# EAGLE design DS1307 (EAGLE 5.06)
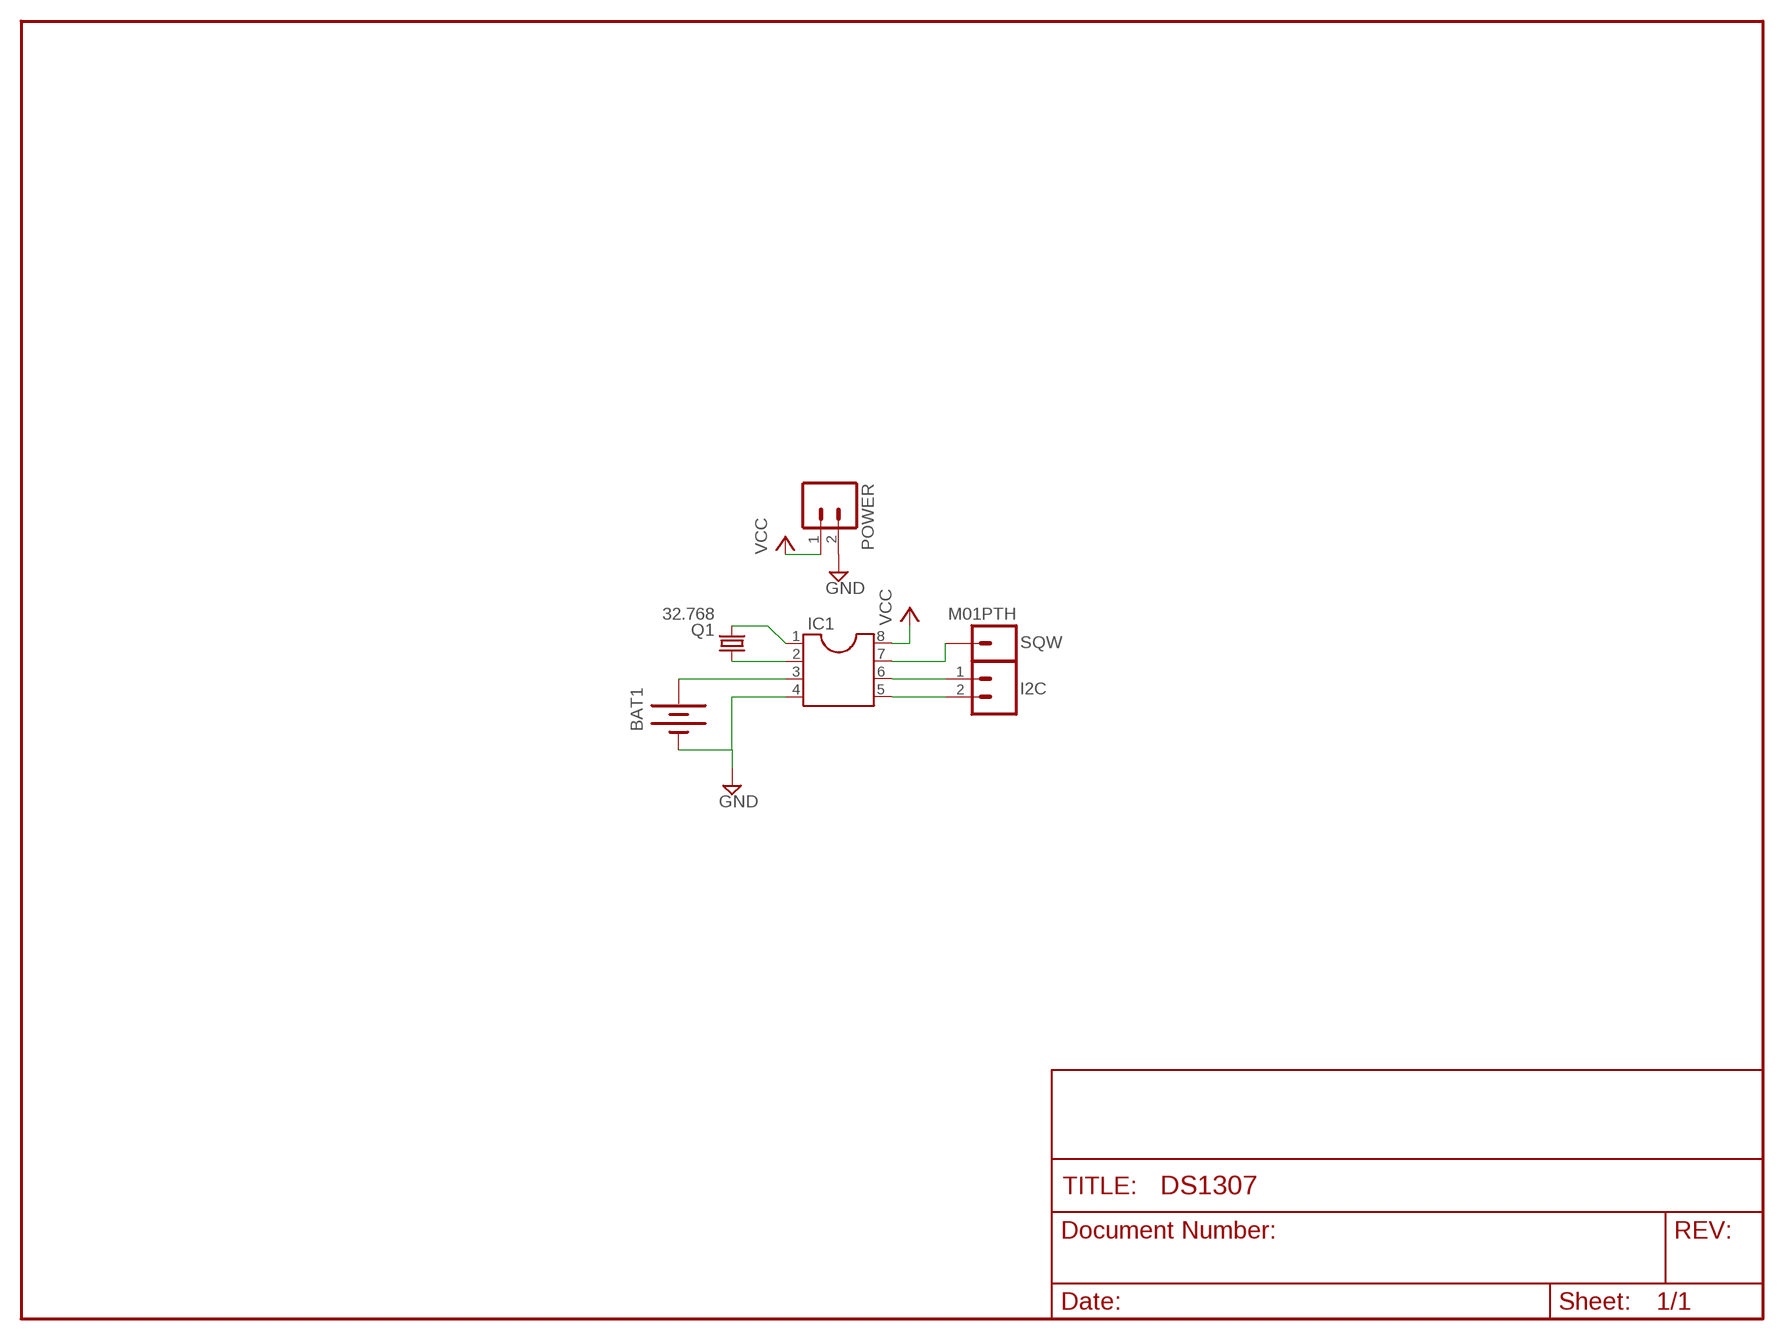
[diagram p0: schematic, sheet 1]

## Parts
BAT1  BATTERY12PTH  [BATTCON_12MM_PTH]
I2C  M02LOCK  [1X02_LOCK]
IC1  DIL8  [DIL08]
POWER  M02LOCK  [1X02_LOCK]
Q1  32.768  CRYSTALTC38H  [TC38H]
SQW  M01PTH  [1X01]

## Nets
GND: BAT1.GND(-) IC1.4 POWER.2
N$1: I2C.1 IC1.6
N$2: BAT1.VCC@1(+) IC1.3
N$3: IC1.1 Q1.2
N$4: IC1.2 Q1.1
N$5: I2C.2 IC1.5
N$6: IC1.7 SQW.1
VCC: IC1.8 POWER.1

## Library data of the parts
BAT1 = SparkFun:BATTERY: Battery Holders Various common sizes : AA, AAA, 20mm coin cell and 12mm coin cell.
I2C POWER = SparkFun:M02: Header 2 Standard 2-pin 0.1" header. Use with straight break away headers (SKU : PRT-00116), right angle break away headers (PRT-00553), swiss pins (PRT-00743), machine pins (PRT-00117), and female headers (PRT-00115). Molex polarized connector foot print use with SKU : PRT-08233 with associated crimp pins and housings.
IC1 = ic-package:DIL8: Dual In Line / Socket
Q1 = crystal:CRYSTAL: CRYSTAL
SQW = SparkFun:M01: Header 1 Standard 1-pin 0.1" header. Use with straight break away headers (SKU : PRT-00116), right angle break away headers (PRT-00553), swiss pins (PRT-00743), machine pins (PRT-00117), and female headers (PRT-00115).

## Board
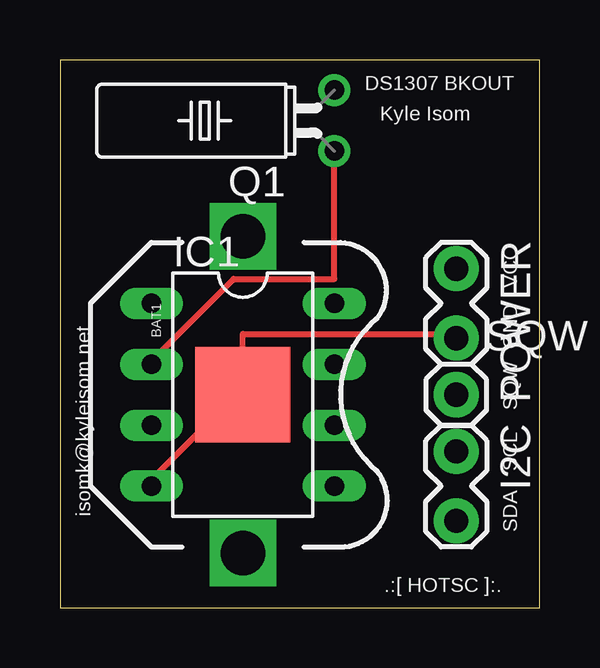
[diagram p1: board, top side]
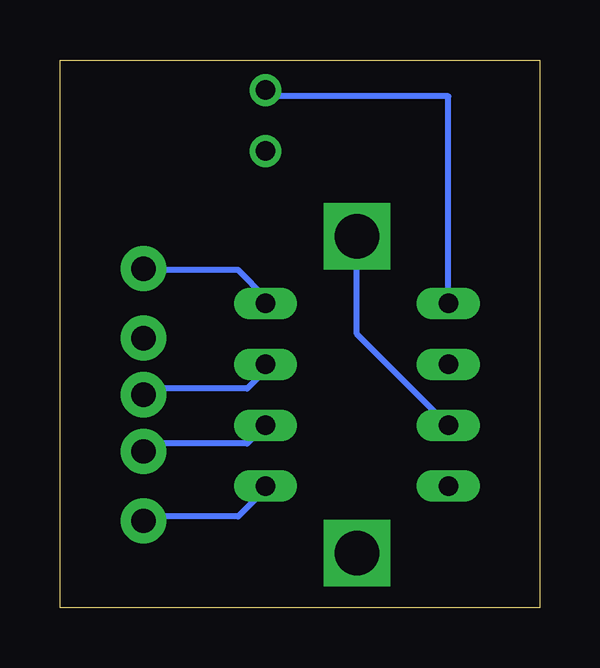
[diagram p2: board, bottom side, seen from below]

Size 19.99 x 22.85 mm. Coordinates in mm from the lower left corner, seen from the top.
Outline: 0,0 19.99,0 19.99,22.85 0,22.85 0,0
Copper layers (1*16): Top 0.035mm / dielectric 1.5mm / Bottom 0.035mm
Design rules "default": minimum track width 10mil, minimum drill 24mil, track to track 8mil, track to pad 8mil, pad to pad 8mil, via to via 8mil, smd to smd 8mil, copper to edge 40mil, drill to drill 8mil, minimum pad ring 10mil, minimum via ring 8mil, stop-mask expansion 4mil, vias tented up to drill 0mil, thermal gap 10mil

### Footprints (pad centres in the part's own frame; a part is rotated, then mirrored left to right if it is on the bottom)
BATTCON_12MM_PTH = smd 3.962 x 3.962: GND 0,0 | drill 1.854 square: VCC@1 -6.604,0; VCC@2 6.604,0
1X02_LOCK = drill 1.016 pad 1.88 round: 1 -0.178,0; 2 2.718,0
DIL08 = drill 0.813 long: 1 -3.81,-3.81; 2 -1.27,-3.81; 3 1.27,-3.81; 4 3.81,-3.81; 5 3.81,3.81; 6 1.27,3.81; 7 -1.27,3.81; 8 -3.81,3.81
TC38H = drill 0.813 round: 1 -1.27,0; 2 1.27,0
1X01 = drill 1.016 pad 1.88 round: 1 0,0

### Placement (x,y rotation side)
BAT1  7.62,8.89 270 top
I2C  16.51,6.35 270 top
IC1  7.62,8.89 270 top
POWER  16.51,13.97 270 top
Q1  11.43,20.32 90 top
SQW  16.51,8.89 0 top

### Tracks (layer width: path | path; a pad name or v marks a point on that pad's centre or on a via)
GND
  Top 0.254: 7.62,9.14 3.81,5.33 IC1.4 | 7.62,9.14 7.62,11.43 16.38,11.43 POWER.2 | 7.62,9.14 BAT1.GND
N$1
  Bottom 0.254: IC1.6 12.19,6.86 16.38,6.86 I2C.1
N$2
  Bottom 0.254: IC1.3 7.62,11.43 BAT1.VCC@1
N$3
  Bottom 0.254: IC1.1 3.81,21.34 11.43,21.34 Q1.2
N$4
  Top 0.254: Q1.1 11.43,13.72 7.24,13.72 3.81,10.29 IC1.2
N$5
  Bottom 0.254: IC1.5 11.43,4.95 12.57,3.81 16.38,3.81 I2C.2
N$6
  Bottom 0.254: IC1.7 11.43,9.91 12.19,9.14 16.38,9.14 SQW.1
VCC
  Bottom 0.254: IC1.8 11.43,12.95 12.57,14.1 16.38,14.1 POWER.1

### Text on the board
tPlace: DS1307 BKOUT | Kyle Isom | VCC | GND | SQW | SCL | isomk@kyleisom.net | SDA | .:[ HOTSC ]:.